# EAGLE design ece411-t04-filamint-V5.2 (EAGLE 7.7.0)
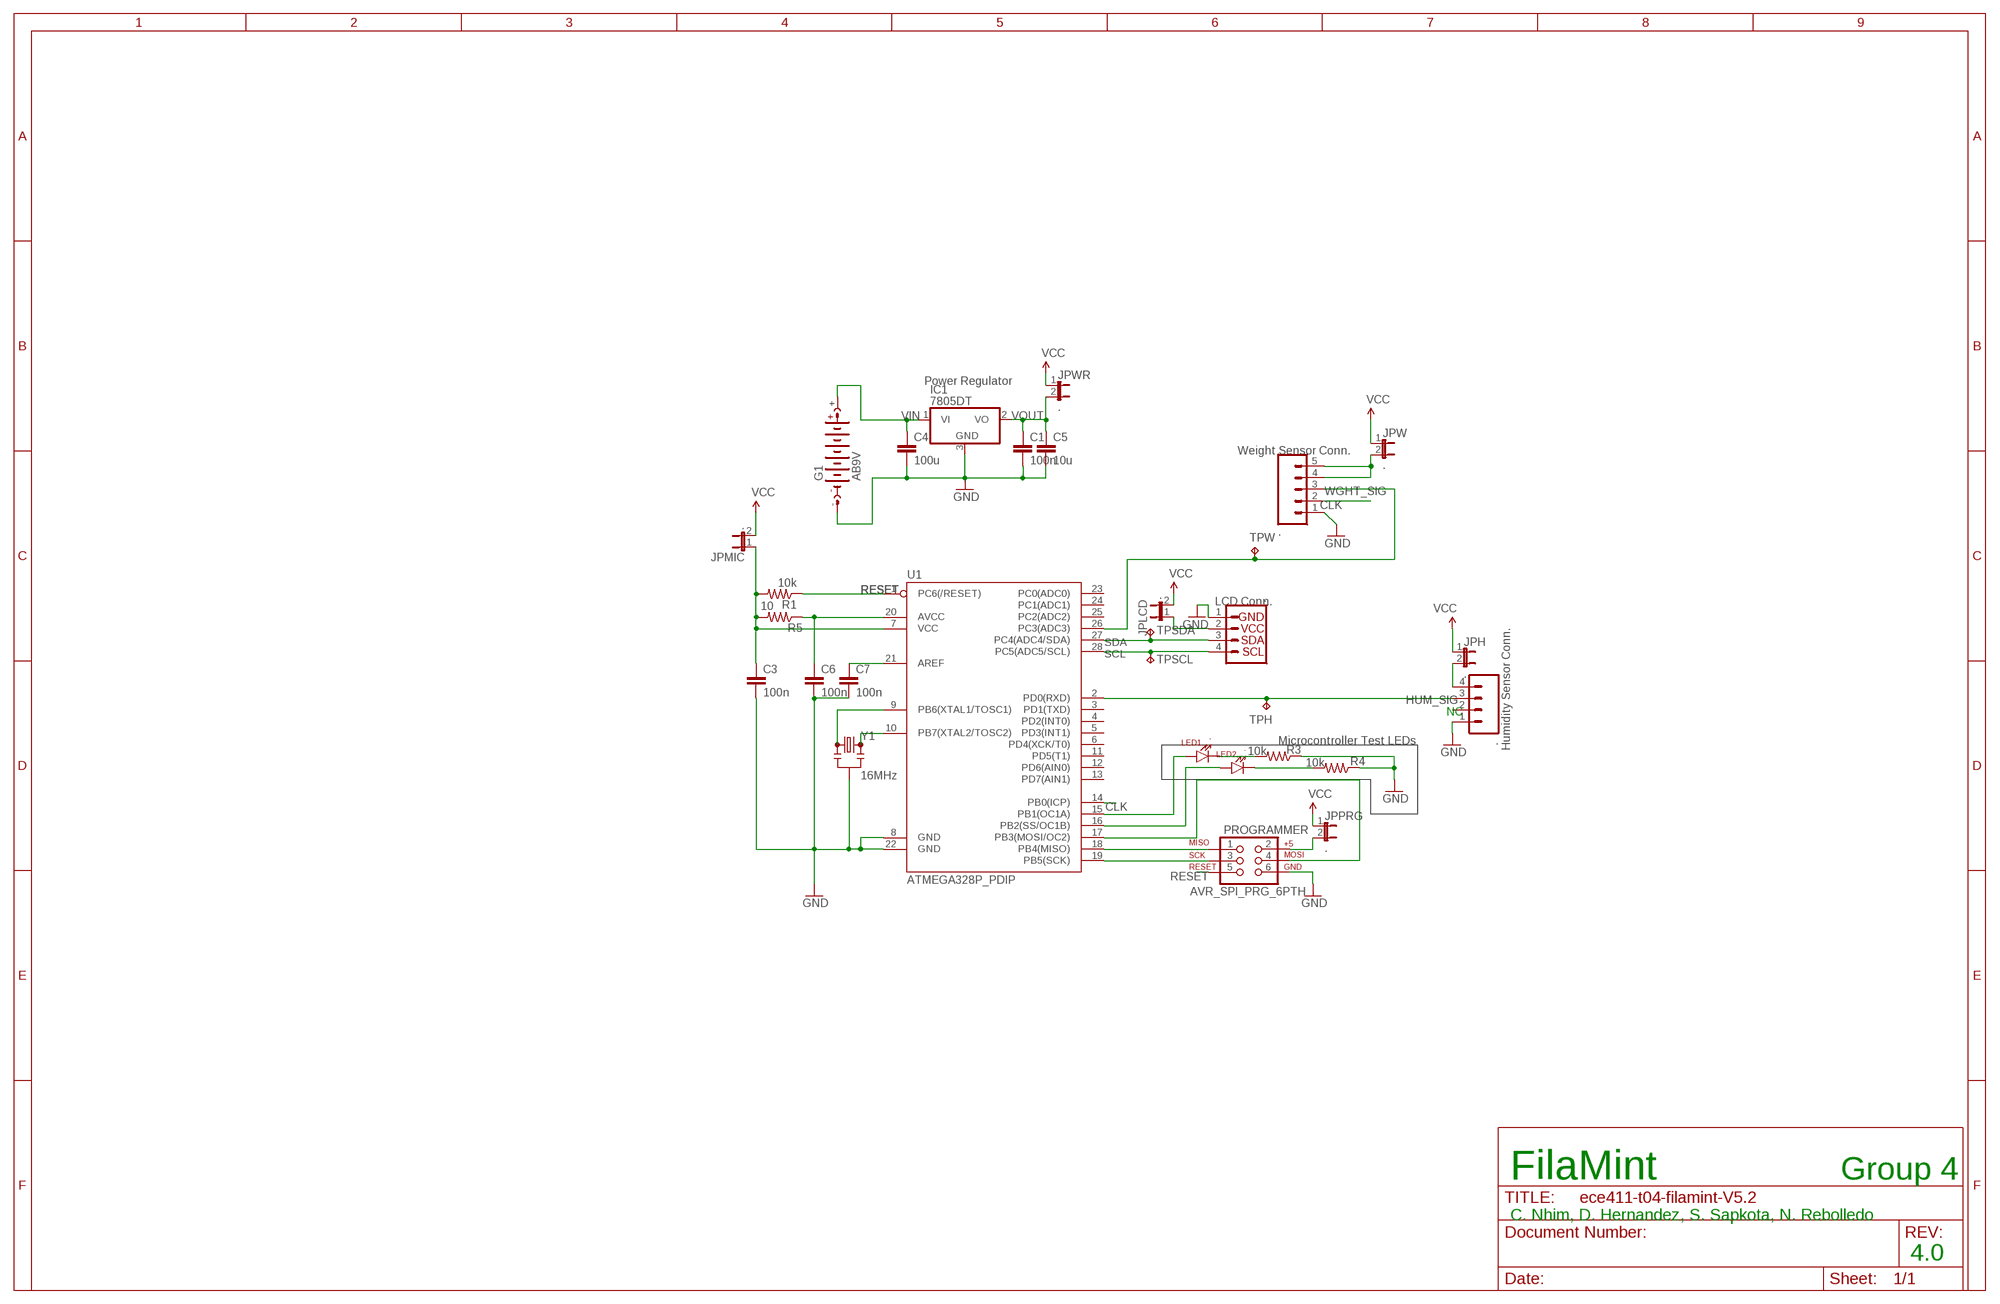
[diagram p0: schematic, sheet 1]

## Parts
C1  100n  C-EUC0805  [C0805]
C3  100n  C-EUC0805  [C0805]
C4  100u  C-EU025-024X044  [C025-024X044]
C5  10u  C-EU025-024X044  [C025-024X044]
C6  100n  C-EUC0805  [C0805]
C7  100n  C-EUC0805  [C0805]
DHT22  .  M04SMD2  [1X04-1MM-RA]
G1  AB9V  [AB9V]
HX711  .  M05SMD  [1X05-1MM]
IC1  7805DT  [TO252]
JPH  .  JP1E  [JP1]
JPLCD  .  JP1E  [JP1]
JPMIC  .  JP1E  [JP1]
JPPRG  .  JP1E  [JP1]
JPW  .  JP1E  [JP1]
JPWR  .  JP1E  [JP1]
LCD  .  I2C_STANDARD  [1X04]
LED1  .  LTE-302  [LTE-302]
LED2  .  LTE-302  [LTE-302]
PROGRAMMER  AVR_SPI_PRG_6PTH  [2X3]
R1  10k  R-US_0204/5  [0204/5]
R3  10k  R-US_0204/5  [0204/5]
R4  10k  R-US_0204/5  [0204/5]
R5  10  R-US_0204/5  [0204/5]
TPH  TPB1,27  [B1,27]
TPSCL  TPB1,27  [B1,27]
TPSDA  TPB1,27  [B1,27]
TPW  TPB1,27  [B1,27]
U1  ATMEGA328P_PDIP  [DIL28-3]
Y1  16MHz  RESONATORPTH  [RESONATOR-PTH]

## Nets
AVCC: C6.1 R5.1 U1.20(AVCC)
CLK: HX711.2 U1.14(PB0(ICP))
GND: C1.2 C3.2 C4.2 C5.2 C6.2 C7.2 DHT22.1 G1.- HX711.1 IC1.3(GND) LCD.1 PROGRAMMER.6 R3.1 R4.1 U1.8(GND) U1.22(GND) Y1.2
HUM_SIG: DHT22.3 TPH.TP U1.2(PD0(RXD))
MISO: PROGRAMMER.1 U1.18(PB4(MISO))
MOSI: PROGRAMMER.4 U1.17(PB3(MOSI/OC2))
N$1: U1.9(PB6(XTAL1/TOSC1)) Y1.1
N$2: U1.10(PB7(XTAL2/TOSC2)) Y1.3
N$3: HX711.4 HX711.5 JPW.2
N$5: C7.1 U1.21(AREF)
N$11: LED1.A U1.15(PB1(OC1A))
N$22: LED2.A U1.16(PB2(SS/OC1B))
N$23: DHT22.4 JPH.2
N$24: LED1.C R3.2
N$25: LED2.C R4.2
N$26: JPPRG.2 PROGRAMMER.2
N$27: C3.1 JPMIC.1 R1.2 R5.2 U1.7(VCC)
N$28: JPLCD.1 LCD.2
N$29: C1.1 C5.1 IC1.2(VO) JPWR.2
RESET: PROGRAMMER.5 R1.1 U1.1(PC6(/RESET))
SCK: PROGRAMMER.3 U1.19(PB5(SCK))
SCL: LCD.4 TPSCL.TP U1.28(PC5(ADC5/SCL))
SDA: LCD.3 TPSDA.TP U1.27(PC4(ADC4/SDA))
VCC: JPH.1 JPLCD.2 JPMIC.2 JPPRG.1 JPW.1 JPWR.1
VIN: C4.1 G1.+ IC1.1(VI)
WGHT_SIG: HX711.3 TPW.TP U1.26(PC3(ADC3))
Unconnected: DHT22.2 U1.3(PD1(TXD)) U1.4(PD2(INT0)) U1.5(PD3(INT1)) U1.6(PD4(XCK/T0)) U1.11(PD5(T1)) U1.12(PD6(AIN0)) U1.13(PD7(AIN1)) U1.23(PC0(ADC0)) U1.24(PC1(ADC1)) U1.25(PC2(ADC2))

## Notes on the sheet
- Power Regulator
- VOUT
- Weight Sensor Conn.
- LCD Conn.
- NC
- Microcontroller Test LEDs
- Humidity Sensor Conn.
- FilaMint | Group 4
- C. Nhim, D. Hernandez, S. Sapkota, N. Rebolledo
- 4.0

## Library data of the parts
C1 C3-C7 = rcl:C-EU: CAPACITOR, European symbol
DHT22 = SparkFun-Connectors:M04: Header 4 Standard 4-pin 0.1" header. Use with straight break away headers (SKU : PRT-00116), right angle break away headers (PRT-00553), swiss pins (PRT-00743), machine pins (PRT-00117), and female headers (PRT-00115). Molex polarized connector foot print use with SKU : PRT-08231 with associated crimp pins and housings. 1MM SMD Version SKU: PRT-10208
G1 = battery:AB9V: 9-V BATTERY CLIP
HX711 = SparkFun-Connectors:M05: Header 5 Standard 5-pin 0.1" header. Use with straight break away headers (SKU : PRT-00116), right angle break away headers (PRT-00553), swiss pins (PRT-00743), machine pins (PRT-00117), and female headers (PRT-00115). Molex polarized connector foot print use with SKU : PRT-08230 with associated crimp pins and housings.
IC1 = linear:78*: Positive VOLTAGE REGULATOR Source: http://cache.national.com/ds/LM/LM78L05.pdf http://www.fairchildsemi.com/ds/LM/LM7805.pdf
JPH JPLCD JPMIC JPPRG JPW JPWR = jumper:JP1E: JUMPER
LCD = SparkFun-Connectors:I2C_STANDARD: SparkFun has standardized on a pinout for all I2C based sensor breakouts. This pinout allows I2C boards to be plugged directly into the headers on Arduino Uno compatible boards, and to be daisy chained easily.
LED1 LED2 = SparkFun-LED:LTE-302: Through-hole side-firing 940nm IR LED
PROGRAMMER = SparkFun-Connectors:AVR_SPI_PRG_6: AVR ISP 6 Pin This is the reduced ISP connector for AVR programming. Common on Arduino. This footprint will take up less PCB space and can be used with a 10-pin to 6-pin adapter such as SKU: BOB-08508 **Special note about "TEST_POINT" package. The stop mask is on the top side, so if you want your programming test points to be on the bottom of your board, make sure to place this package on the bottom side of the board. This also ensure that the orientation to program from the bottom side will be correct.
R1 R3-R5 = rcl:R-US_: RESISTOR, American symbol
TPH TPSCL TPSDA TPW = testpad:TP: Test pad
U1 = SparkFun-DigitalIC:ATMEGA328P_PDIP: uC used in the Arduino 32kb flash, 1k EEPROM, 2k SRAM This is the through-hole version of this chip.
Y1 = SparkFun-FreqCtrl:RESONATOR: Resonator Small SMD resonator. Used, eg, on the Arduino Pro/ Pro Mini boards. 8MHz- XTAL-08895 16MHz- XTAL-08900

## Net classes
0 default: clearance 0.205 mm

## Board
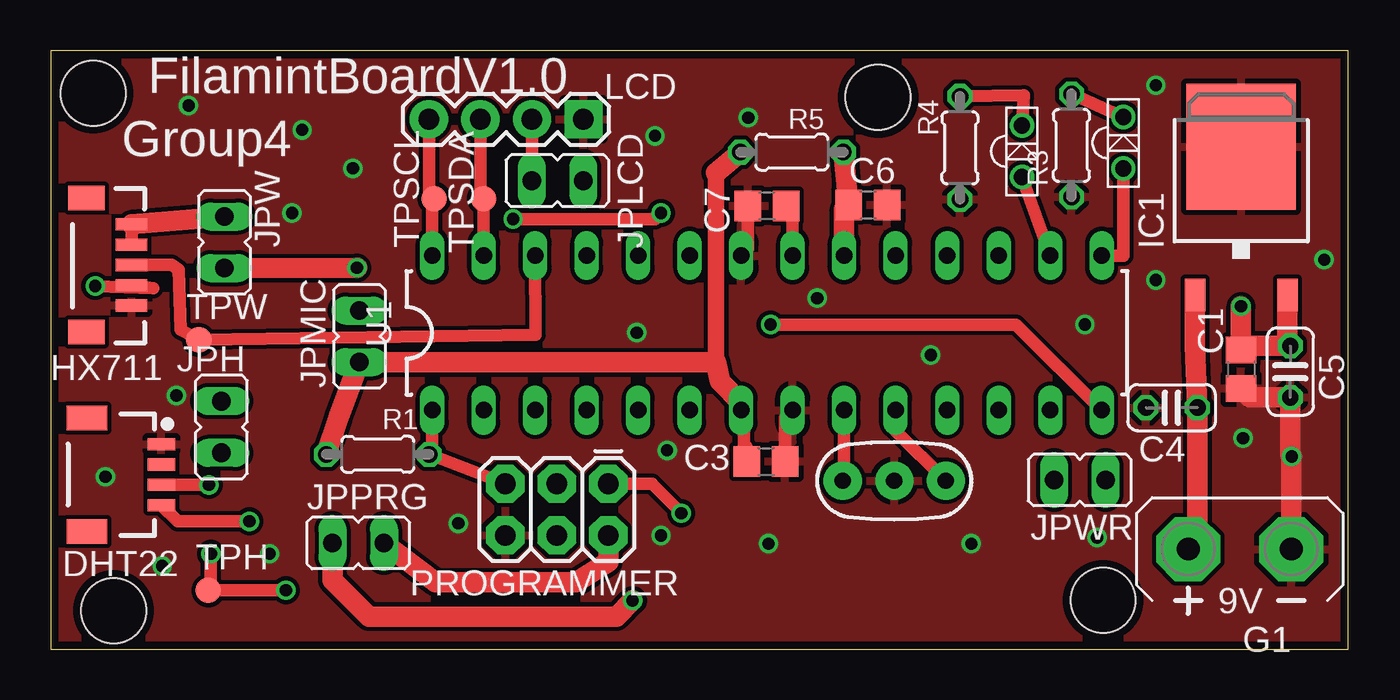
[diagram p1: board, top side]
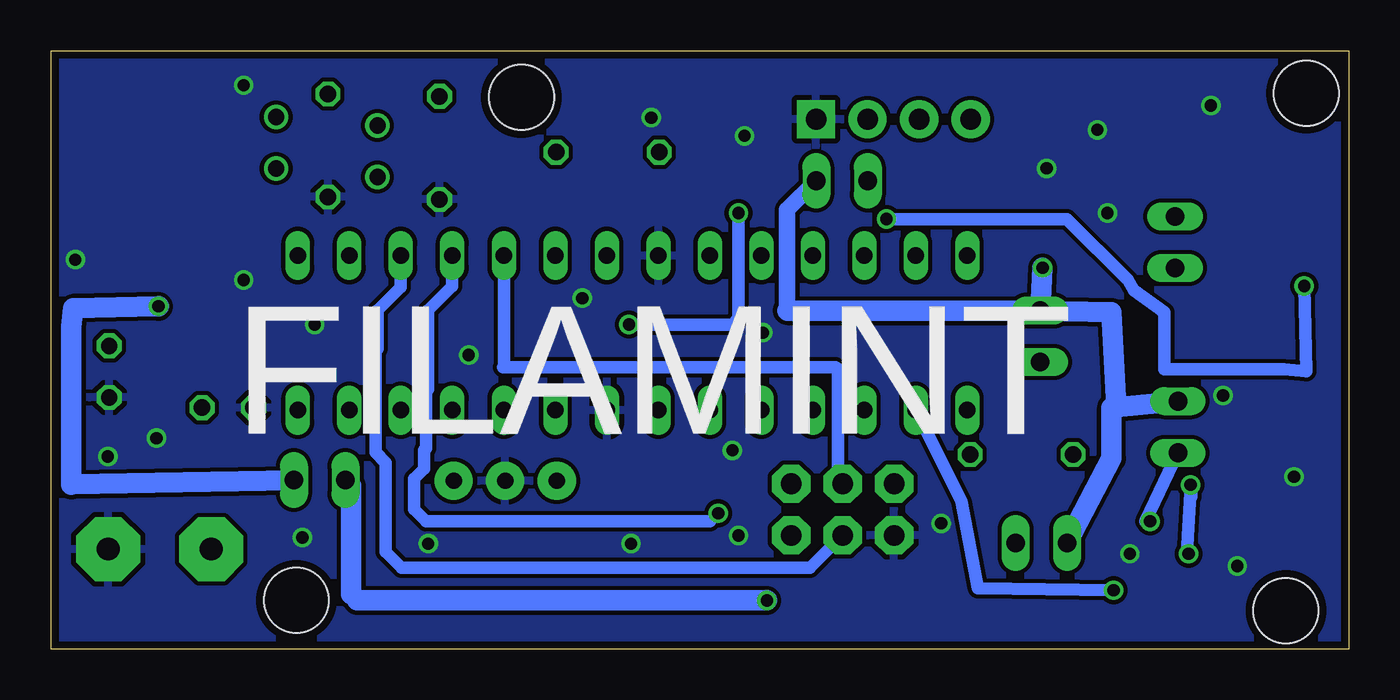
[diagram p2: board, bottom side, seen from below]

Size 64 x 29.5 mm. Coordinates in mm from the lower left corner, seen from the top.
Outline: 0,0 64,0 64,29.5 0,29.5 0,0
Copper layers (1*16): Top 0.0356mm / dielectric 1.5011mm / Bottom 0.0356mm
Design rules "OSH-Park-2-layer": minimum track width 6mil, minimum drill 13mil, track to track 6mil, track to pad 6mil, pad to pad 6mil, via to via 6mil, smd to smd 6mil, copper to edge 15mil, drill to drill 6mil, minimum pad ring 7mil, minimum via ring 7mil, stop-mask expansion 3mil, vias tented up to drill 0mil, thermal gap 10mil
Holes 3.2 mm at 3.1,1.9 51.9,2.4 40.8,27.2 2.1,27.4

### Footprints (pad centres in the part's own frame; a part is rotated, then mirrored left to right if it is on the bottom)
C0805 = smd 1.3 x 1.5: 1 -0.95,0; 2 0.95,0
C025-024X044 = drill 0.813 octagon: 1 -1.27,0; 2 1.27,0
1X04-1MM-RA = smd 0.6 x 1.35: 1 -1.5,0; 2 -0.5,0; 3 0.5,0; 4 1.5,0 | smd 1.2 x 2: NC1 2.8,-3.675; NC2 -2.8,-3.675
AB9V = drill 1.118 pad 3.15 octagon: + 0,2.54; - 0,-2.54
1X05-1MM = smd 0.6 x 1.55: 1 -2,0; 2 -1,0; 3 0,0; 4 1,0; 5 2,0 | smd 1.2 x 1.8: NC1 -3.3,2.225; NC2 3.3,2.225
TO252 = smd 1 x 1.6: 1 -2.28,-4.8; 2 2.28,-4.8 | smd 5.4 x 6.2: 3 0,2.5
JP1 = drill 0.914 long: 1 0,-1.27; 2 0,1.27
1X04 = drill 1.016 pad 1.88 square: 1 0,0 | drill 1.016 pad 1.88: 2 2.54,0; 3 5.08,0; 4 7.62,0
LTE-302 = drill 0.8: A 1.27,0; C -1.27,0
2X3 = drill 1.016 pad 1.88 octagon: 1 0,0; 2 0,2.54; 3 2.54,0; 4 2.54,2.54; 5 5.08,0; 6 5.08,2.54
0204/5 = drill 0.813 octagon: 1 -2.54,0; 2 2.54,0
B1,27 = smd 1.27 x 1.27: TP 0,0
DIL28-3 = drill 0.813 long: 1 -16.51,-3.81; 2 -13.97,-3.81; 3 -11.43,-3.81; 4 -8.89,-3.81; 5 -6.35,-3.81; 6 -3.81,-3.81; 7 -1.27,-3.81; 8 1.27,-3.81; 9 3.81,-3.81; 10 6.35,-3.81; 11 8.89,-3.81; 12 11.43,-3.81; 13 13.97,-3.81; 14 16.51,-3.81; 15 16.51,3.81; 16 13.97,3.81; 17 11.43,3.81; 18 8.89,3.81; 19 6.35,3.81; 20 3.81,3.81; 21 1.27,3.81; 22 -1.27,3.81; 23 -3.81,3.81; 24 -6.35,3.81; 25 -8.89,3.81; 26 -11.43,3.81; 27 -13.97,3.81; 28 -16.51,3.81
RESONATOR-PTH = drill 0.8 pad 1.88: 1 -2.54,0; 2 0,0; 3 2.54,0

### Placement (x,y rotation side)
C1  58.7,13.8 270 top
C3  35.27,9.25 0 top
C4  55.28,11.9 180 top
C5  61.13,13.68 270 top
C6  40.3,21.9 0 top
C7  35.33,21.85 180 top
DHT22  5.46,8.6 270 top
G1  58.64,4.93 90 top
HX711  3.99,18.94 90 top
IC1  58.71,22.26 0 top
JPH  8.43,10.95 180 top
JPLCD  24.99,23.09 270 top
JPMIC  15.22,15.42 0 top
JPPRG  15.17,5.23 270 top
JPW  8.56,20.05 0 top
JPWR  50.75,8.33 270 top
LCD  26.27,26.12 180 top
LED1  52.9,24.96 270 top
LED2  47.9,24.54 270 top
PROGRAMMER  27.5,8.15 180 top
R1  16.13,9.6 180 top
R3  50.34,24.83 90 top
R4  44.84,24.71 90 top
R5  36.55,24.5 180 top
TPH  7.77,2.9 0 top
TPSCL  18.91,22.21 0 top
TPSDA  21.35,22.21 0 top
TPW  7.31,15.24 0 top
U1  35.32,15.59 0 top
Y1  41.6,8.3 0 top

### Tracks (layer width: path | path; a pad name or v marks a point on that pad's centre or on a via)
AVCC
  Top 0.406: 39.13,21.68 C6.1
  Top 1.016: U1.20 39.13,21.68 | R5.1 C6.1
CLK  (via drill 0.6)
  Top 0.61: U1.14 47.61,16 v35.5,16 | v30.1,21.5 29.8,21.2 v22.8,21.2 | HX711.2 5.05,17.8 v2.2,17.9
  Bottom 0.61: v35.5,16 30.4,16 30.1,16.3 v30.1,21.5 | v22.8,21.2 13.9,21.2 10.9,18.2 10.6,17.7 9.1,16.6 9.1,13.8 3.2,13.8 2.1,13.7 v2.2,17.9
GND  (via drill 0.6)
  Top 0.61: U1.8 36.22,11.41 C3.2 | U1.22 34.38,19.73 C7.2
  Top 1.016: C1.2 59.14,12.41 C5.2 61.13,9.57 v61.2,9.5 61.18,9.48 G1.-
  other vias: 11.9,21.5 6.2,12.5 54.5,18.2 34.4,26.2 14.9,23.7 12.4,25.6 6.8,26.8 29.8,25.3 2.7,8.5 5.5,4.1 10.8,4.7 20.1,6.2 28.9,15.6 30.1,5.6 30.4,9.8 35.4,5.2 43.4,14.5 37.8,17.3 51,16 58.8,10.4 51.6,5.5 45.4,5.2 62.8,19.2 54.5,27.8
  pour Bottom (isolate 0.01): 0,29.5 64,29.5 64,0 0,0
  pour Top: 0,0 0,29.5 64,29.5 64,0 60,0.1
HUM_SIG  (via drill 0.6)
  Top 0.61: v11.6,2.9 TPH.TP 7.9,2.9 v7.9,4.7 | DHT22.3 v7.8,8.1 8,8.1
  Bottom 0.61: U1.2 19.1,7.3 18.3,3 v11.6,2.9 | 7.77,7.5 v7.8,8.1 8,4.7 v7.9,4.7
MISO  (via drill 0.6)
  Top 0.61: PROGRAMMER.1 29.65,8.15 v31.1,6.7
  Bottom 0.61: v31.1,6.7 31.5,6.3 45.5,6.3 46.1,6.9 46.1,8.4 45.6,8.9 45.6,9.8 45.5,9.9 45.5,12.7 45.4,12.8 45.4,16.7 44.21,17.89 U1.18
MOSI
  Bottom 0.61: PROGRAMMER.4 26.57,4 46.7,4 47.5,4.8 47.5,9.2 48,9.7 48,14.7 47.9,14.8 47.9,16.7 46.75,17.85 U1.17
N$1
  Top 0.406: 39.13,8.37 Y1.1
  Top 0.61: U1.9 39.13,8.37
N$2
  Top 0.61: U1.10 41.67,10.77 Y1.3
N$3
  Top 0.61: HX711.5 HX711.4
  Top 1.016: JPW.2 HX711.5
N$5
  Top 0.406: 36.59,21.54 C7.1
  Top 0.61: U1.21 36.59,21.54
N$11
  Top 0.61: U1.15 52.9,19.4 LED1.A
N$22
  Top 0.61: U1.16 LED2.A
N$23  (via drill 0.6)
  Top 0.61: DHT22.4 6.26,6.3 v9.8,6.3
  Bottom 0.61: v9.8,6.3 10.03,6.3 JPH.2
N$24
  Top 0.61: R3.2 LED1.C
N$25
  Top 0.61: R4.2 48,27.3 LED2.C
N$26
  Top 1.016: JPPRG.2 18.97,3.3 25.9,3.3 27.5,4.3 PROGRAMMER.2
N$27
  Top 0.406: C3.1 34.32,9.98
  Top 0.61: 34.32,9.98 34.2,10.1 34.2,11.63 U1.7 34.05,12.15
  Top 0.813: 32.8,23.49 32.8,14.15
  Top 1.016: R5.2 32.8,23.49 | 34.05,12.15 33,13.2 32.8,14.15 JPMIC.1 14.19,11.42 R1.2
N$28
  Top 0.61: JPLCD.1 23.7,23.1 | JPLCD.1 LCD.2 | JPLCD.1
N$29  (via drill 0.6)
  Top 1.016: IC1.2 60.99,15.09 C5.1 58.9,14.95 C1.1 v58.7,16.9
  Bottom 1.016: v58.7,16.9 62.9,16.8 63,15.9 63,8.1 62.97,8.13 JPWR.2
RESET
  Top 0.61: U1.1 18.81,9.44 R1.1 PROGRAMMER.5
SCK
  Bottom 0.61: PROGRAMMER.3 arc90 25.2,8.39 25.2,13.7 arc-90 25.4,13.9 41.7,13.9 arc-90 41.67,13.93 U1.19
SCL
  Top 0.406: 18.81,22.11 TPSCL.TP 18.65,22.47
  Top 0.61: U1.28 18.81,22.11 | LCD.4 18.65,22.47
SDA
  Top 0.406: 21.19,22.37 TPSDA.TP
  Top 0.61: U1.27 TPSDA.TP | LCD.3 21.19,22.37
VCC  (via drill 0.6)
  Top 1.016: JPW.1 v15.1,18.8 | v28.7,2.4 27.9,1.6 15.7,1.6 13.9,3.4 JPPRG.1
  Bottom 0.61: JPWR.1 49.2,8.05 | 49.2,2.7 48.9,2.4
  Bottom 0.813: JPLCD.2 27.7,21.65 27.7,16.7 27.69,16.69
  Bottom 1.016: v15.1,18.8 JPMIC.2 | 27.69,16.69 JPMIC.2 | 49.2,8.05 49.2,2.7 | 48.9,2.4 v28.7,2.4 | JPPRG.1 11.7,9.4 11.7,11.9 11.45,11.92 | 11.45,11.92 JPH.1 | JPMIC.2 11.7,16.6 11.45,11.92
VIN
  Top 1.016: IC1.1 56.43,14.98 C4.1 56.55,5.38 G1.+
WGHT_SIG
  Top 0.61: HX711.3 5.96,18.94 6.3,18.7 6.4,15.75 TPW.TP 23.9,15.5 U1.26

### Text on the board
tPlace: FilamintBoardV1.0 | Group4
_bsilk: FILAMINT